# EAGLE design throwing_star (EAGLE 6.4)
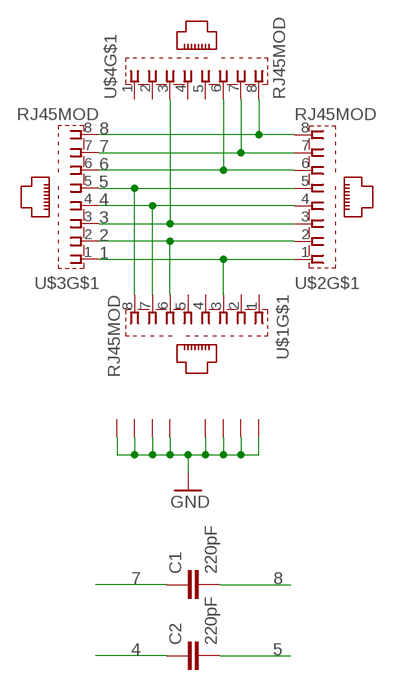
[diagram p0: schematic, sheet 1]

## Parts
C1  220pF  C-EU050-024X044  [C050-024X044]
C2  220pF  C-EU050-024X044  [C050-024X044]
U$1  RJ45MOD  [RJ45MOD]
U$2  RJ45MOD  [RJ45MOD]
U$3  RJ45MOD  [RJ45MOD]
U$4  RJ45MOD  [RJ45MOD]

## Nets
1: U$1.3 U$2.1 U$3.1
2: U$1.6 U$2.2 U$3.2
3: U$2.3 U$3.3 U$4.3
4: C2.1 U$1.7 U$2.4 U$3.4
5: C2.2 U$1.8 U$2.5 U$3.5
6: U$2.6 U$3.6 U$4.6
7: C1.1 U$2.7 U$3.7 U$4.7
8: C1.2 U$2.8 U$3.8 U$4.8
GND: U$1.G3 U$1.G4 U$2.G3 U$2.G4 U$3.G3 U$3.G4 U$4.G3 U$4.G4
Unconnected: U$1.1 U$1.2 U$1.4 U$1.5 U$4.1 U$4.2 U$4.4 U$4.5

## Library data of the parts
C1 C2 = resistor:C-EU: CAPACITOR, European symbol
U$1-U$4 = con-appsys:RJ45MOD

## Board
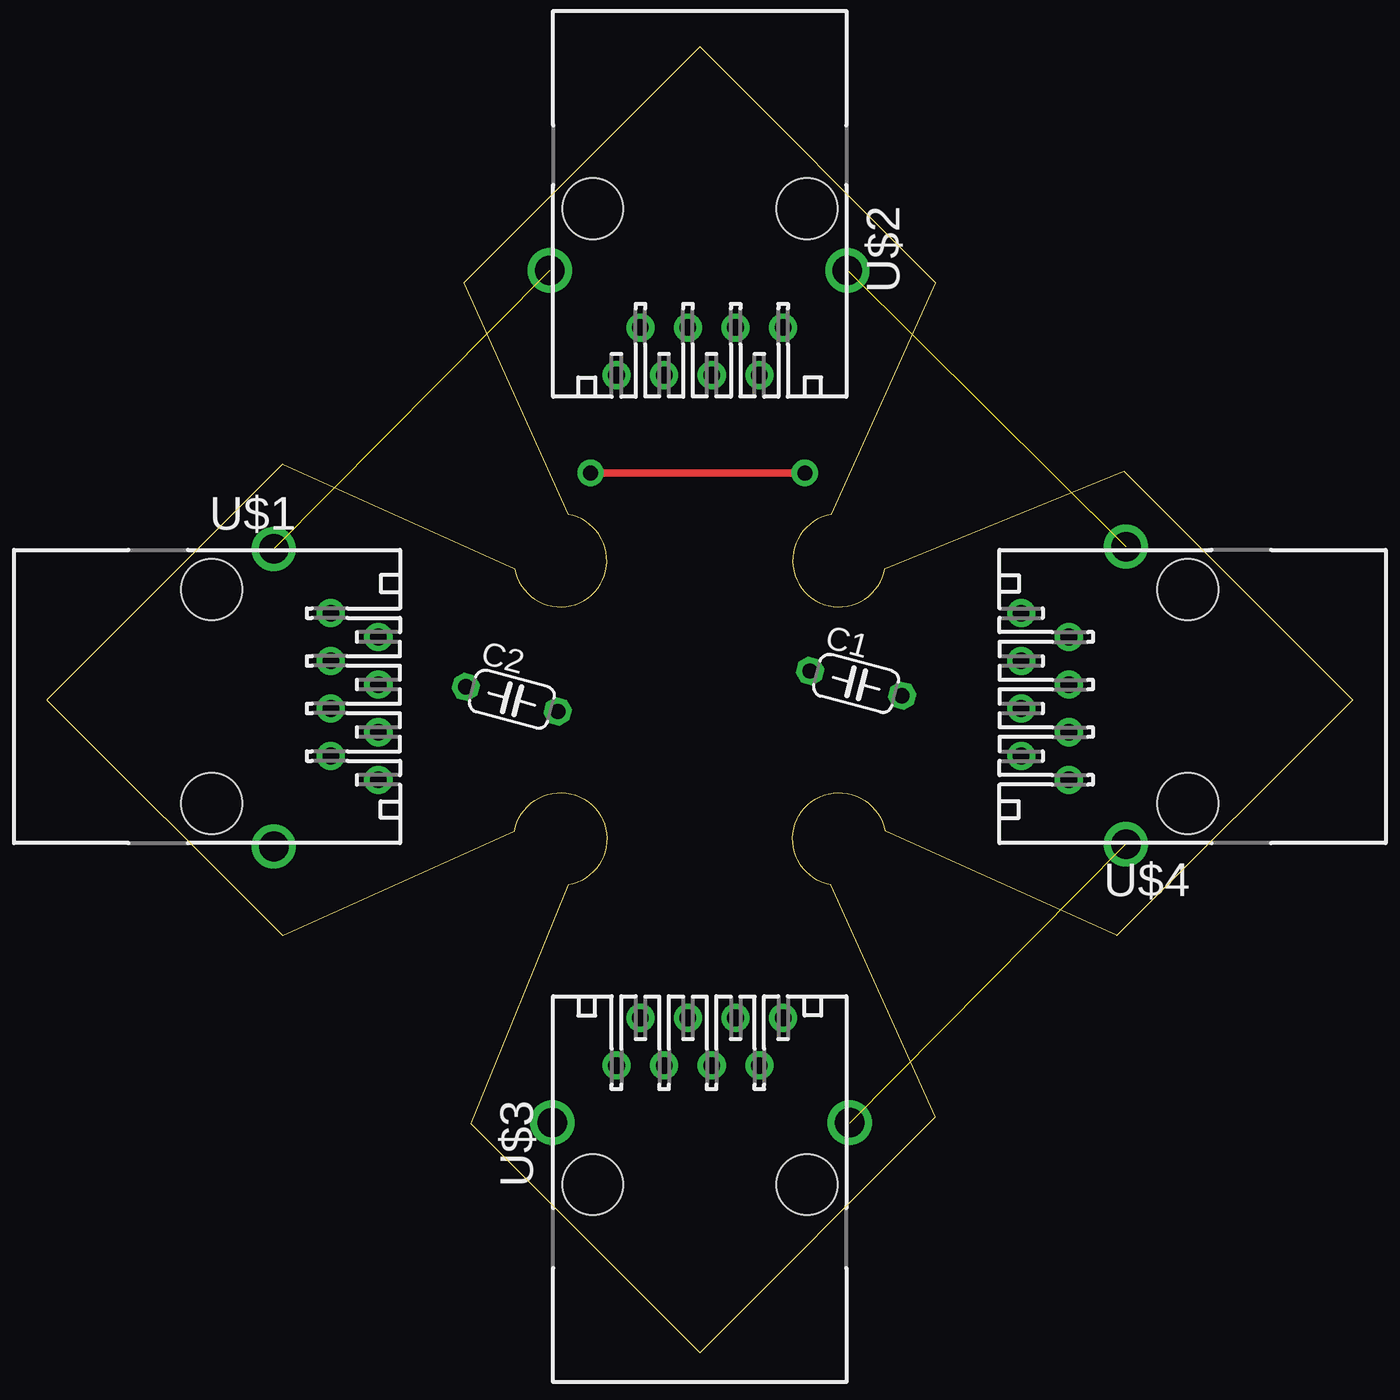
[diagram p1: board, top side]
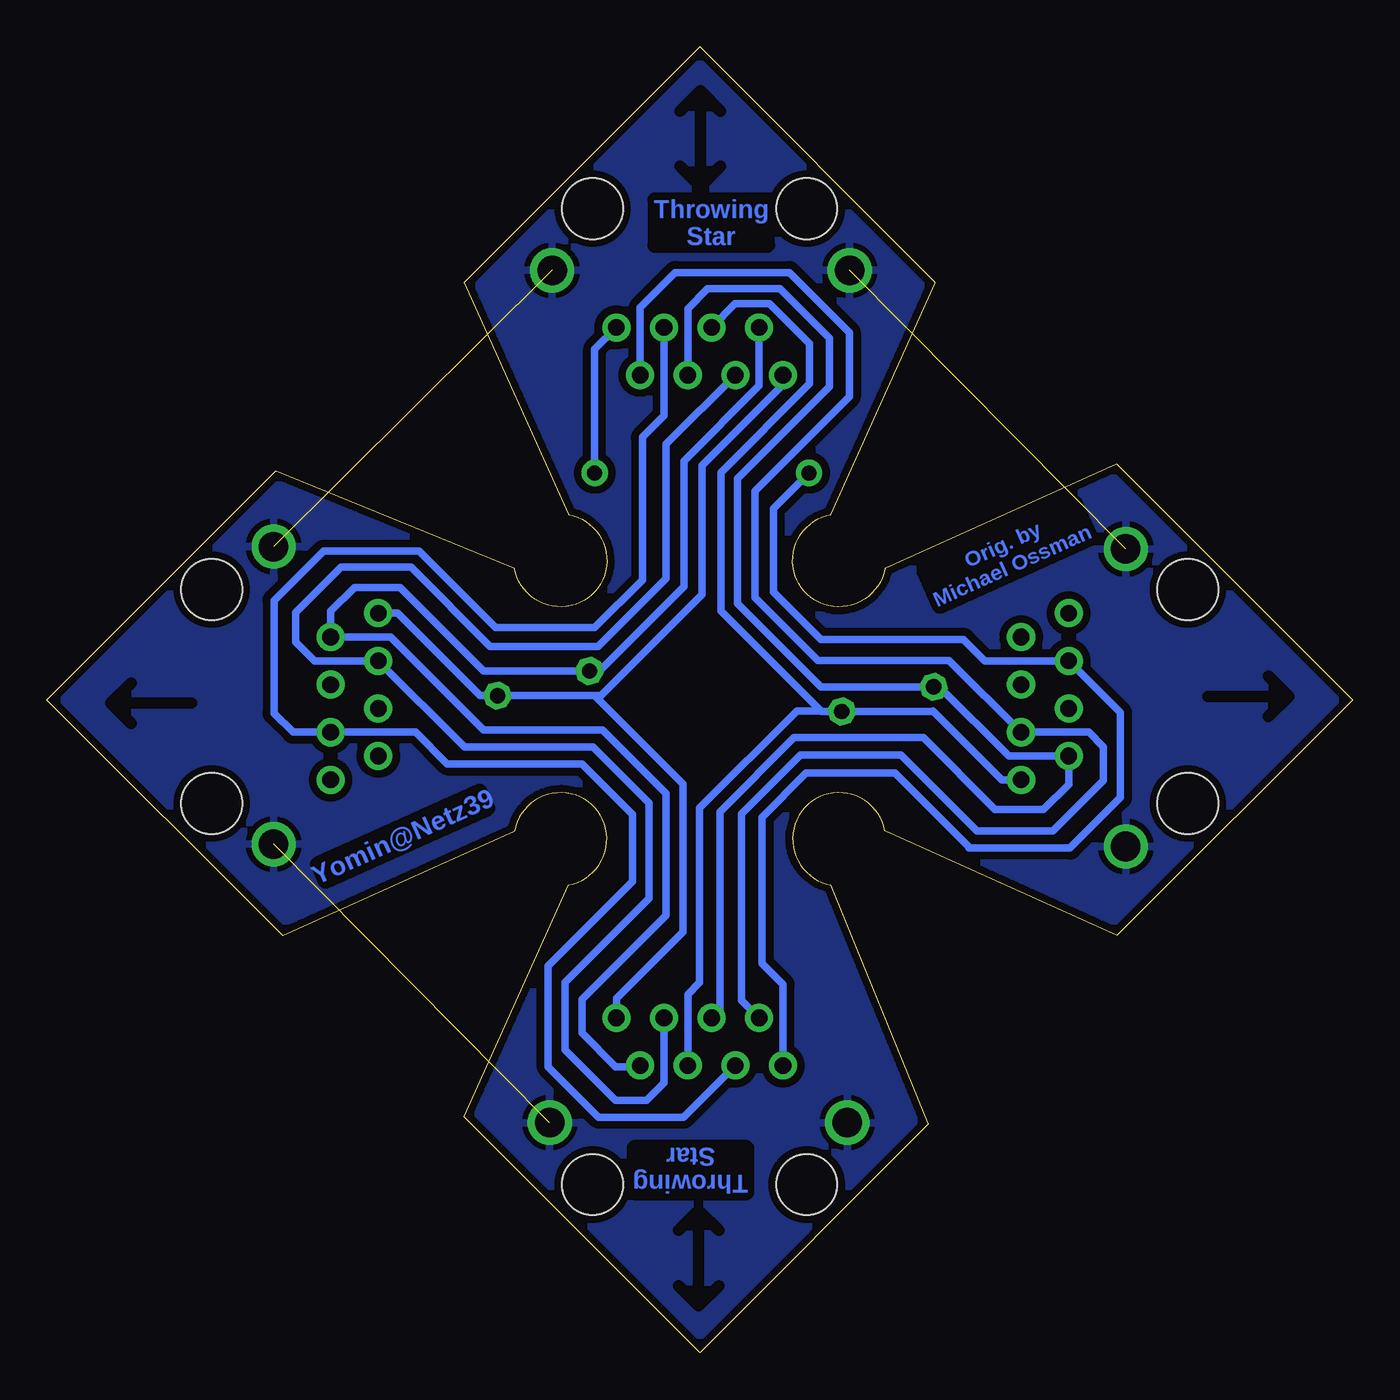
[diagram p2: board, bottom side, seen from below]

Size 69.69 x 69.69 mm. Coordinates in mm from the lower left corner, seen from the top.
Outline: 0.01,34.84 12.57,22.27 24.97,27.84 arc-250 27.84,24.97 22.63,12.21 34.84,0 47.42,12.57 41.85,24.97 arc-250 44.72,27.84 57.11,22.27 69.69,34.84 57.47,47.06 44.72,41.85 arc-250 41.85,44.72 47.42,57.11 34.84,69.69 22.27,57.11 27.84,44.72 arc-250 24.97,41.85 12.57,47.42 0,34.84
Copper layers (1*16): Top 0.035mm / dielectric 1.5mm / Bottom 0.035mm
Design rules "normal *": minimum track width 12mil, minimum drill 30mil, track to track 16mil, track to pad 12mil, pad to pad 12mil, via to via 12mil, smd to smd 8mil, copper to edge 16mil, drill to drill 16mil, minimum pad ring 12mil, minimum via ring 12mil, stop-mask expansion 4mil, vias tented up to drill 0mil, thermal gap 12mil
bRestrict: 16 lines

### Footprints (pad centres in the part's own frame; a part is rotated, then mirrored left to right if it is on the bottom)
C050-024X044 = drill 0.813 octagon: 1 -2.54,0; 2 2.54,0
RJ45MOD = drill 0.889: 1 -4.445,6.35; 2 -3.175,8.89; 3 -1.905,6.35; 4 -0.635,8.89; 5 0.635,6.35; 6 1.905,8.89; 7 3.175,6.35; 8 4.445,8.89 | drill 1.575 pad 2.184: G3 -7.874,3.302; G4 8.001,3.302 | hole 3.251: -5.715,0; 5.715,0

### Placement (x,y rotation side)
C1  43.18,35.72 345 top
C2  24.81,34.88 345 top
U$1  8.8,35.02 270 top
U$2  34.85,61.06 180 top
U$3  34.85,8.97 0 top
U$4  60.89,35.02 90 top

### Tracks (layer width: path | path; a pad name or v marks a point on that pad's centre or on a via)
1  (via drill 0.8)
  Top 0.406: v29.02,46.95 v40.45,46.95
  Bottom 0.406: U$3.1 30.4,19.65 31.53,20.78 31.53,28.56 29.17,30.93 24.42,30.93 20.48,26.99 20.48,26.93 15.09,26.93 12.4,29.63 12.4,34.16 U$1.3 19.62,36.92 20.76,38.06 28.38,38.06 30.92,40.6 30.92,45.05 v29.02,46.95 | v40.45,46.95 40.45,53.56 U$2.1
2
  Bottom 0.406: U$2.2 38.02,55.78 36.15,57.65 30.06,57.65 26.86,54.45 26.86,51.02 31.89,45.99 31.89,40.3 28.53,36.95 21.55,36.95 17.71,33.11 U$1.6 | U$1.6 14.08,33.11 13.29,32.32 13.29,30.53 15.99,27.83 20.05,27.83 24.11,31.89 29.47,31.89 32.61,28.75 32.61,18.8 U$3.2 | U$1.6
3
  Bottom 0.406: U$3.3 35.7,12.57 40.24,12.57 42.93,15.26 42.93,20.65 38.44,25.14 38.44,28.73 41.13,31.42 48.32,31.42 50,33.11 U$4.3 | U$4.3 56.55,33.11 57.56,34.12 57.56,40.14 54.93,42.78 49.83,42.78 45.75,38.7 40.45,38.7 37.91,41.24 37.91,48.86 36.75,50.01 U$2.3 | U$4.3
4
  Bottom 0.406: U$2.4 35.48,55.73 34.43,56.78 30.56,56.78 27.92,54.14 27.92,51.55 32.83,46.65 32.83,39.97 28.38,35.52 28.37,35.53 C2.1 22.04,35.53 18.35,31.84 U$1.7 15.15,30.33 16.49,29 19.08,29 22.92,32.83 29.8,32.83 33.77,28.87 33.77,18.31 U$3.4
5
  Bottom 0.406: U$3.5 35.48,19.11 34.85,19.75 34.85,29.06 29.65,34.25 28.38,34.25 | U$2.5 32.95,55.97 31.12,55.97 28.99,53.84 28.99,51.7 33.71,46.98 33.71,39.59 28.38,34.25 | U$1.8 18.73,30.57 22.41,34.25 22.44,34.22 C2.2 28.35,34.22 28.38,34.25 | U$1.8
6
  Bottom 0.406: 55.39,36.92 56.4,37.93 56.4,39.51 53.99,41.91 50.26,41.91 46.03,37.68 40.26,37.68 36.64,41.31 36.64,48.48 U$2.6 | 55.39,36.92 | 55.39,36.92 U$4.6 | U$4.6 | U$4.6 47.4,32.32 40.54,32.32 37.54,29.32 37.54,24.24 42.03,19.75 42.03,16.16 39.34,13.46 37.69,13.46 36.75,14.4 U$3.6
7
  Bottom 0.406: U$2.7 31.67,51.61 35.7,47.59 35.7,40.88 40.2,36.38 C1.1 46.38,36.38 50.84,40.84 53.27,40.84 54.54,39.57 U$4.7 51.34,38.19 46.37,33.22 40.02,33.22 36.64,29.84 36.64,23.34 41.13,18.85 41.13,17.06 39.34,15.26 38.09,15.26 U$3.7
8
  Bottom 0.406: U$3.8 39.29,18.9 35.75,22.44 35.75,30.36 40.45,35.06 | U$2.8 30.4,51.66 34.73,47.33 34.73,40.45 40.12,35.06 40.45,35.06 | U$4.8 50.97,39.46 46.57,35.06 C1.2 40.45,35.06
GND  (3 unrouted)
  pour Bottom: -0.83,34.89 34.73,70.45 70.29,34.89 34.73,-0.67

### Text on the board
Bottom: Throwing / Star | Orig. by / Michael Ossman | Yomin@Netz39 | Throwing / Star